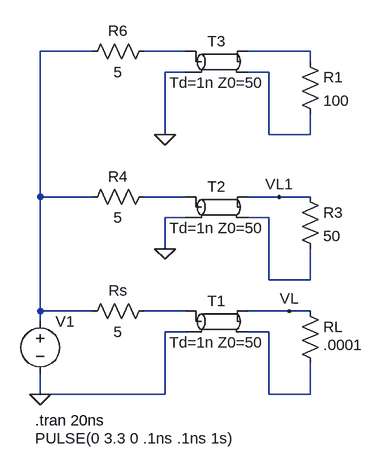
[diagram p0: schematic Tline_3_cases.asc]
Tline_3_cases.asc, the LTspice schematic file:
Version 4
SHEET 1 880 680
WIRE 16 -256 -64 -256
WIRE 160 -256 96 -256
WIRE 352 -256 256 -256
WIRE 352 -240 352 -256
WIRE 160 -224 128 -224
WIRE 288 -224 256 -224
WIRE 128 -128 128 -224
WIRE 288 -128 288 -224
WIRE 352 -128 352 -160
WIRE 352 -128 288 -128
WIRE -64 -32 -64 -256
WIRE 16 -32 -64 -32
WIRE 160 -32 96 -32
WIRE 304 -32 256 -32
WIRE 352 -32 304 -32
WIRE 160 0 128 0
WIRE 288 0 256 0
WIRE 128 48 128 0
WIRE 288 96 288 0
WIRE 352 96 352 48
WIRE 352 96 288 96
WIRE -64 144 -64 -32
WIRE 16 144 -64 144
WIRE 160 144 96 144
WIRE 320 144 256 144
WIRE 352 144 320 144
WIRE -64 160 -64 144
WIRE 160 176 128 176
WIRE 288 176 256 176
WIRE -64 272 -64 240
WIRE 128 272 128 176
WIRE 128 272 -64 272
WIRE 288 272 288 176
WIRE 352 272 352 224
WIRE 352 272 288 272
FLAG -64 272 0
FLAG 128 48 0
FLAG 128 -128 0
FLAG 304 -32 VL1
FLAG 320 144 VL
SYMBOL tline 208 160 R0
SYMATTR InstName T1
SYMATTR Value Td=1n Z0=50
SYMBOL res 336 -256 R0
SYMATTR InstName R1
SYMATTR Value 100
SYMBOL res 112 128 R90
WINDOW 0 0 56 VBottom 2
WINDOW 3 32 56 VTop 2
SYMATTR InstName Rs
SYMATTR Value 5
SYMBOL voltage -64 144 R0
WINDOW 123 0 0 Left 0
WINDOW 39 0 0 Left 0
WINDOW 3 -8 196 Left 2
SYMATTR Value PULSE(0 3.3 0 .1ns .1ns 1s)
SYMATTR InstName V1
SYMBOL tline 208 -16 R0
SYMATTR InstName T2
SYMATTR Value Td=1n Z0=50
SYMBOL res 336 -48 R0
SYMATTR InstName R3
SYMATTR Value 50
SYMBOL res 112 -48 R90
WINDOW 0 0 56 VBottom 2
WINDOW 3 32 56 VTop 2
SYMATTR InstName R4
SYMATTR Value 5
SYMBOL tline 208 -240 R0
SYMATTR InstName T3
SYMATTR Value Td=1n Z0=50
SYMBOL res 112 -272 R90
WINDOW 0 0 56 VBottom 2
WINDOW 3 32 56 VTop 2
SYMATTR InstName R6
SYMATTR Value 5
SYMBOL res 336 128 R0
WINDOW 3 36 68 Left 2
SYMATTR InstName RL
SYMATTR Value .0001
TEXT -72 312 Left 2 !.tran 20ns

The netlist it stands for:
* Tline_3_cases.asc
T1 N007 0 VL N008 Td=1n Z0=50
R1 N003 N004 100
Rs N007 N001 5
V1 N001 0 PULSE(0 3.3 0 .1ns .1ns 1s)
T2 N005 0 VL1 N006 Td=1n Z0=50
R3 VL1 N006 50
R4 N005 N001 5
T3 N002 0 N003 N004 Td=1n Z0=50
R6 N002 N001 5
RL VL N008 .0001
.tran 20ns
.backanno
.end